# Altium schematic sheet Jtag.SchDoc
size A; SheetNumber: 4; SheetTotal: 4
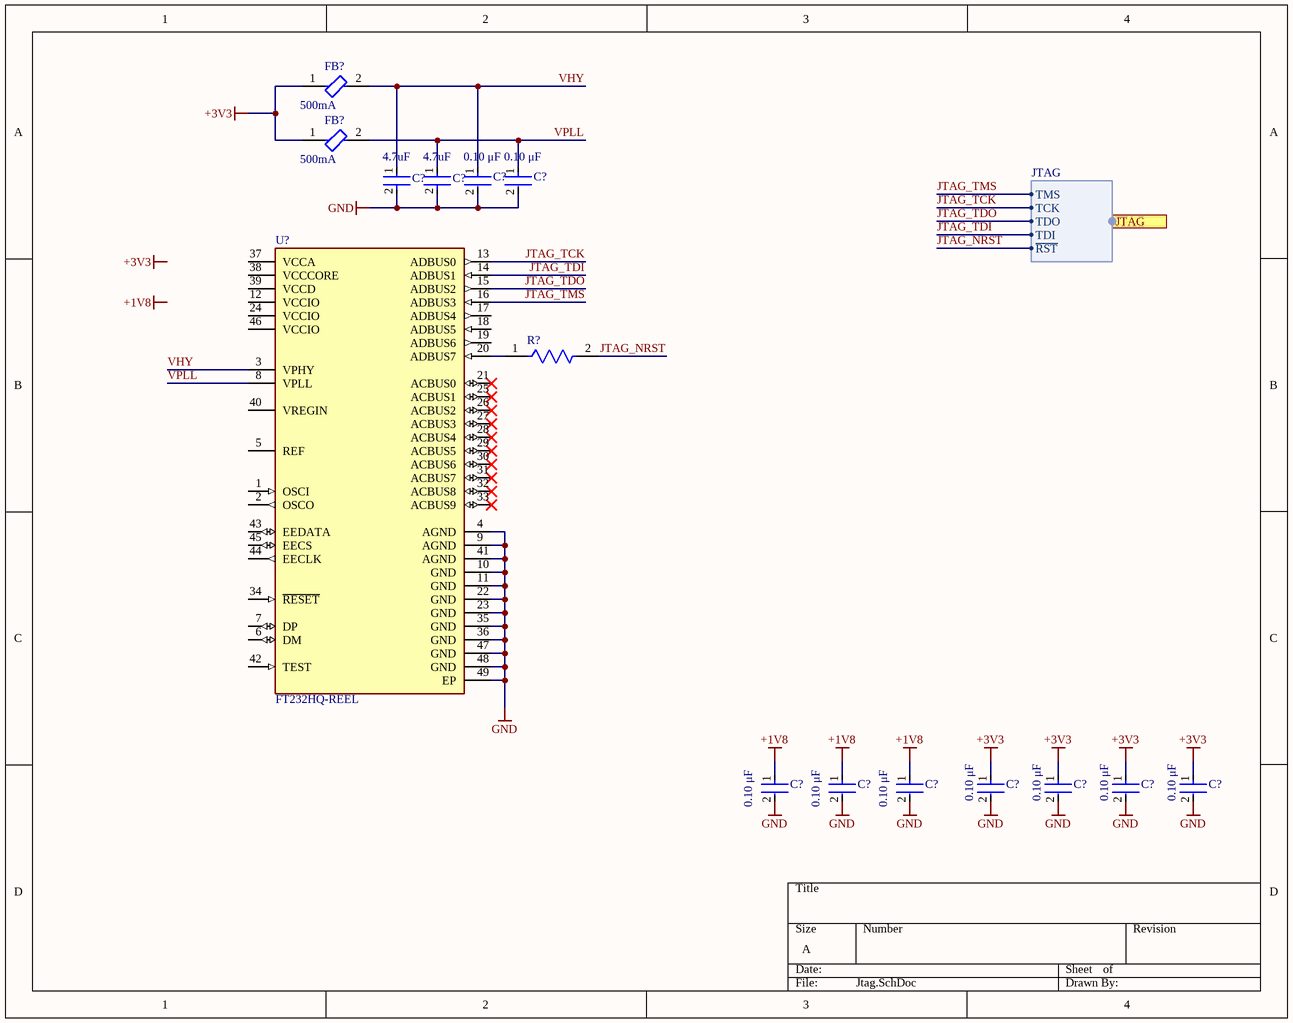
[diagram p0: Jtag.SchDoc]

## Parts
(Parts that share a designator on the sheet are numbered #1, #2 ... from top to bottom, then left to right.)
C?#1  Capacitance: 0.10 μF  [FP-C0402-BB-MFG]  (hidden comment: C0402C104K8PACTU)
C?#2  Capacitance: 0.10 μF  [FP-C0402-BB-MFG]  (hidden comment: C0402C104K8PACTU)
C?#3  Capacitance: 4.7uF  [FP-GRM188-0_1-MFG]  (hidden comment: GRM188R60J475KE19D)
C?#4  Capacitance: 4.7uF  [FP-GRM188-0_1-MFG]  (hidden comment: GRM188R60J475KE19D)
C?#5  Capacitance: 0.10 μF  [FP-C0402-BB-MFG]  (hidden comment: C0402C104K8PACTU)
C?#6  Capacitance: 0.10 μF  [FP-C0402-BB-MFG]  (hidden comment: C0402C104K8PACTU)
C?#7  Capacitance: 0.10 μF  [FP-C0402-BB-MFG]  (hidden comment: C0402C104K8PACTU)
C?#8  Capacitance: 0.10 μF  [FP-C0402-BB-MFG]  (hidden comment: C0402C104K8PACTU)
C?#9  Capacitance: 0.10 μF  [FP-C0402-BB-MFG]  (hidden comment: C0402C104K8PACTU)
C?#10  Capacitance: 0.10 μF  [FP-C0402-BB-MFG]  (hidden comment: C0402C104K8PACTU)
C?#11  Capacitance: 0.10 μF  [FP-C0402-BB-MFG]  (hidden comment: C0402C104K8PACTU)
FB?#1  Max DC Current: 500mA  [FP-BLM18-0_15-t0_8-MFG]  (hidden comment: BLM18AG601SN1D)
FB?#2  Max DC Current: 500mA  [FP-BLM18-0_15-t0_8-MFG]  (hidden comment: BLM18AG601SN1D)
R?  CRCW04020000Z0ED  [FP-CRCW0402-e3-IPC_C]  (value not drawn)
U?  FT232HQ-REEL  [FP-QFN-48-MFG]

## Ports
JTAG (harness JTAG)

## Harnesses
JTAG: TMS, TCK, TDO, TDI, ~{RST}

## Nets
+1V8: C?#5.1 C?#6.1 C?#7.1
+3V3: C?#8.1 C?#9.1 C?#10.1 C?#11.1 FB?#1.1 FB?#2.1
GND: C?#1.2 C?#2.2 C?#3.2 C?#4.2 C?#5.2 C?#6.2 C?#7.2 C?#8.2 C?#9.2 C?#10.2 C?#11.2 U?.4(AGND) U?.9(AGND) U?.10(GND) U?.11(GND) U?.22(GND) U?.23(GND) U?.35(GND) U?.36(GND) U?.41(AGND) U?.47(GND) U?.48(GND) U?.49(EP)
JTAG_NRST: R?.2 ; port JTAG.~{RST}
JTAG_TCK: U?.13(ADBUS0) ; port JTAG.TCK
JTAG_TDI: U?.14(ADBUS1) ; port JTAG.TDI
JTAG_TDO: U?.15(ADBUS2) ; port JTAG.TDO
JTAG_TMS: U?.16(ADBUS3) ; port JTAG.TMS
VHY: C?#1.1 C?#3.1 FB?#1.2 U?.3(VPHY)
VPLL: C?#2.1 C?#4.1 FB?#2.2 U?.8(VPLL)
NetR?_1: R?.1 U?.20(ADBUS7)

Not connected (* = marked no-connect by the designer): U? 1(OSCI) 2(OSCO) 5(REF) 6(DM) 7(DP) 12(VCCIO) 17(ADBUS4) 18(ADBUS5) 19(ADBUS6) 21(ACBUS0)* 24(VCCIO) 25(ACBUS1)* 26(ACBUS2)* 27(ACBUS3)* 28(ACBUS4)* 29(ACBUS5)* 30(ACBUS6)* 31(ACBUS7)* 32(ACBUS8)* 33(ACBUS9)* 34(~{RESET}) 37(VCCA) 38(VCCCORE) 39(VCCD) 40(VREGIN) 42(TEST) 43(EEDATA) 44(EECLK) 45(EECS) 46(VCCIO)

## Notes on the sheet
- Labels drawn without touching a wire or pin: +1V8, +3V3

## Library data of the parts
C?#1 C?#2 C?#5-C?#11 = CMP-2008-02046-2: CAP CER 0.1UF 10V X5R 0402; Manufacturer: Kemet; Material: Ceramic; Temperature Coefficient: 15%; Description: C0402 0.10 μF X5R 10.00% 10 V; Tolerance: 0.1; Value: 0.10 μF; Package: C0402-BB; Temperature: -55°C to +125°C; ComponentLink2Description: Datasheet; Temperature Characteristic: X5R; Device Class L1: Passive Components; Height: 0.55mm; Lead Free: Yes; ComponentLink2URL: https://content.kemet.com/datasheets/KEM_C1002_X7R_SMD.pdf; Device Class L2: Capacitors; Temperature Range Low: -55°C; Temperature Range High: +125°C; RoHS: TRUE; Octopart: https://octopart.com/c0402c104k8pactu-kemet-140039; Automotive: No; Mouser Description: Capacitor 100 nF 10 VDC 0402; Category: Cap; Voltage Rating: 10 V; Digikey Description: CAP CER 0.1UF 10V X5R 0402; Ipc Land Pattern Name: CAPC10050X50; Device Class L3: Ceramic Capacitors; Manufacturer Part Number: C0402C104K8PACTU
C?#3 C?#4 = CMP-2006-02799-3: CAP CER 4.7UF 6.3V X5R 0603; Material: Ceramic; Tolerance: 10%; Max Operating Temperature: 85°C; REACH SVHC: No SVHC; Thickness: 0.035inch; Voltage Rating: 6.3V; Package Quantity: 1; Radiation Hardening: No; Voltage: 6.3V; Case Code (Metric): 1608; Dielectric: X5R; Mount: Surface Mount; RoHS Compliant: Yes; Height: 0.8mm; Voltage Rating (DC): 6.3V; Width: 0.8mm; Lead Free: Lead Free; Case Code (Imperial): 0603; Packaging: Tape and Reel; Length: 1.6mm; Case/Package: 0603; Termination: SMD/SMT; Min Operating Temperature: -55°C; Depth: 0.8mm
FB?#1 FB?#2 = CMP-0686-00436-3: Chip Ferrite Bead, 0603, 600Ω @ 100MHz, 0.38Ω, 25%, 500mA; Number of Lines: 1; Impedance: 600R; DC Resistance (DCR): 380mR; Material: Steel; Shielding: Unshielded; Termination: SMD/SMT; Military Standard: Not; Number of Circuits: 1; Min Operating Temperature: -55°C; Case Code (Imperial): 0603; Width: 0.8mm; Current Rating: 500mA; Lead Free: Lead Free; Packaging: Tape and Reel; Frequency: 100MHz; Max Operating Temperature: 125°C; DC Current: 500mA; REACH SVHC: No SVHC; Case/Package: 0603; Package Quantity: 1; Height: 0.8mm; Number of Pins: 2; Depth: 0.8mm; Test Frequency: 100MHz; Case Code (Metric): 1608; Tolerance: 25%; Core Material: Ferrite; Weight: 7.1E-05oz; Max Current Rating: 500mA; Radiation Hardening: No; Length: 1.6mm; RoHS Compliant: Yes
R? = CMP-2002-08122-2: RES Thick Film, 0Ω, 0.063W, 0402; Tolerance: 5%; Max Power Dissipation: 63mW; Voltage Rating: 50V; Temperature Coefficient: 100ppm/°C; Resistance: 0mR; Contact Plating: Tin; Height: 0.35mm; Radiation Hardening: No; Features: Automotive AEC-Q200; Composition: Thick Film; Width: 0.5mm; Weight: 2.3E-05oz; Termination: SMD/SMT; Packaging: Tape and Reel; Mount: Surface Mount; Case Code (Metric): 1005; Military Standard: Not; Min Operating Temperature: -55°C; Number of Terminations: 2; Package Quantity: 1; Case Code (Imperial): 0402; Depth: 0.5mm; Max Operating Temperature: 155°C; Case/Package: 0402; Power Rating: 63mW; Lead Free: Lead Free; Voltage Rating (DC): 50V; Length: 1mm
U? = CMP-0078-00034-4: IC HS USB TO UART/FIFO 48QFN; Number of Channels: 1; Max Supply Voltage: 3.63V; Min Supply Voltage: 2.97V; Operating Supply Current: 24mA; Data Rate: 12Mbps; Interface: UART; Nominal Supply Current: 60mA; Operating Supply Voltage: 3.3V; Case/Package: QFN; Packaging: Tape and Reel; Weight: 0.005309oz; Number of Pins: 48; REACH SVHC: No SVHC; Length: 7mm; Mount: Surface Mount; Package Quantity: 1; Lead Free: Lead Free; Radiation Hardening: No; Max Operating Temperature: 85°C; Min Operating Temperature: -40°C; Height: 1.4mm; Width: 7mm